# EAGLE design BRX (EAGLE 6.2)
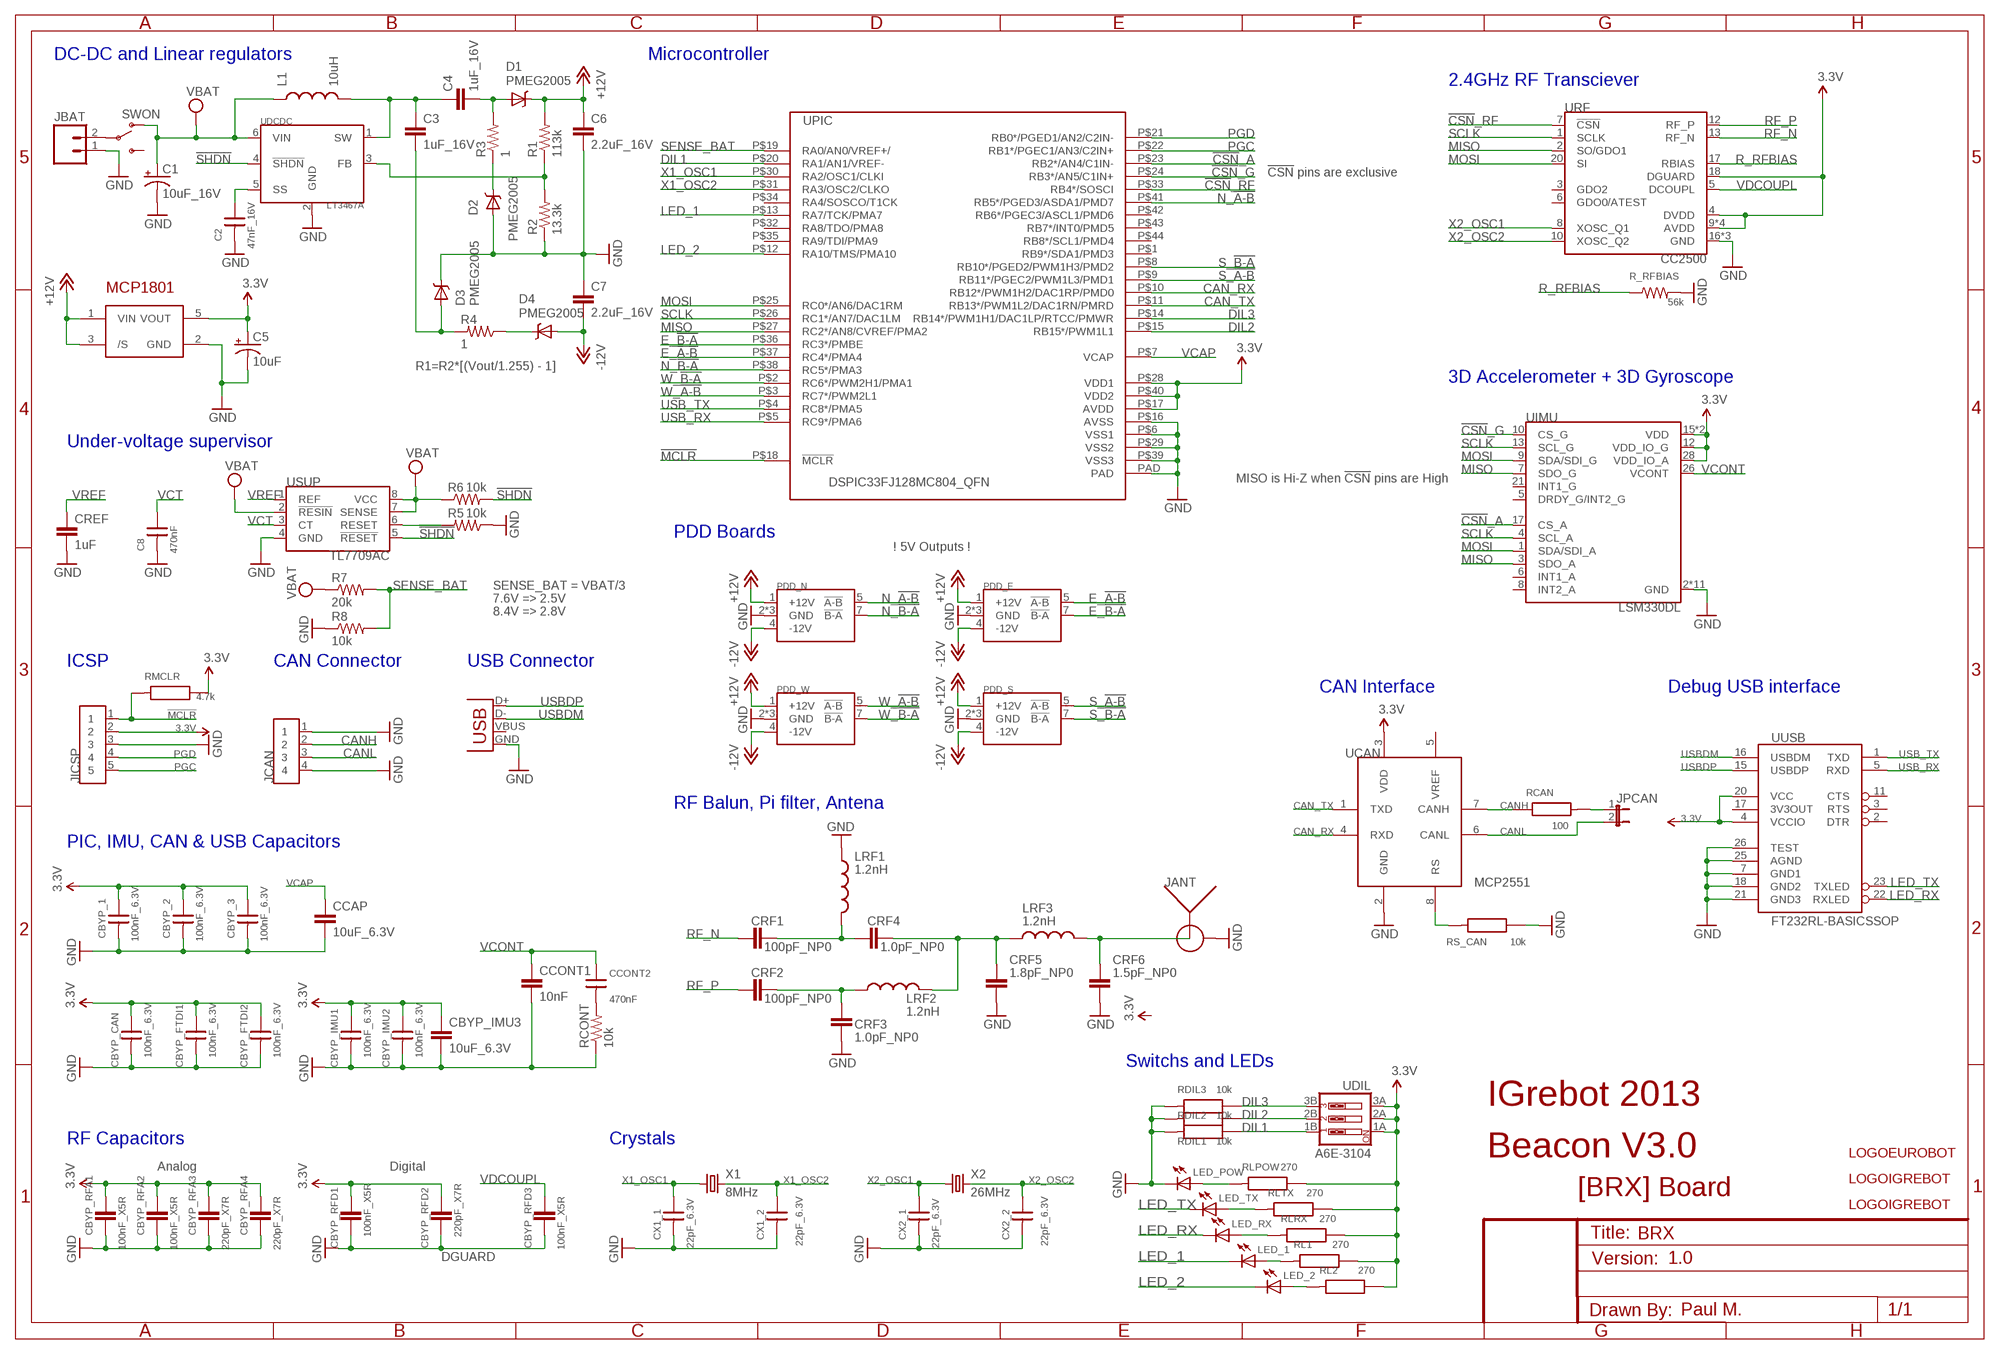
[diagram p0: schematic, sheet 1]

## Parts
C1  10uF_16V  CAP_POLC  [PANASONIC_C]
C2  47nF_16V  C0603  [R0603]
C3  1uF_16V  CAP1210  [1210]
C4  1uF_16V  CAP1210  [1210]
C5  10uF  CAP_POLC  [PANASONIC_C]
C6  2.2uF_16V  CAP1210  [1210]
C7  2.2uF_16V  CAP1210  [1210]
C8  470nF  C0603  [R0603]
CBYP_1  100nF_6.3V  C0603  [R0603]
CBYP_2  100nF_6.3V  C0603  [R0603]
CBYP_3  100nF_6.3V  C0603  [R0603]
CBYP_CAN  100nF_6.3V  C0603  [R0603]
CBYP_FTDI1  100nF_6.3V  C0603  [R0603]
CBYP_FTDI2  100nF_6.3V  C0603  [R0603]
CBYP_IMU1  100nF_6.3V  C0603  [R0603]
CBYP_IMU2  100nF_6.3V  C0603  [R0603]
CBYP_IMU3  10uF_6.3V  CAP1206  [1206]
CBYP_RFA1  100nF_X5R  CAP0402-CAP  [0402-CAP]
CBYP_RFA2  100nF_X5R  CAP0402-CAP  [0402-CAP]
CBYP_RFA3  220pF_X7R  CAP0402-CAP  [0402-CAP]
CBYP_RFA4  220pF_X7R  CAP0402-CAP  [0402-CAP]
CBYP_RFD1  100nF_X5R  CAP0402-CAP  [0402-CAP]
CBYP_RFD2  220pF_X7R  CAP0402-CAP  [0402-CAP]
CBYP_RFD3  100nF_X5R  CAP0402-CAP  [0402-CAP]
CCAP  10uF_6.3V  CAP1206  [1206]
CCONT1  10nF  CAP1206  [1206]
CCONT2  470nF  C0603  [R0603]
CREF  1uF  CAP1210  [1210]
CRF1  100pF_NP0  CAP0402-CAP  [0402-CAP]
CRF2  100pF_NP0  CAP0402-CAP  [0402-CAP]
CRF3  1.0pF_NP0  CAP0402-CAP  [0402-CAP]
CRF4  1.0pF_NP0  CAP0402-CAP  [0402-CAP]
CRF5  1.8pF_NP0  CAP0402-CAP  [0402-CAP]
CRF6  1.5pF_NP0  CAP0402-CAP  [0402-CAP]
CX1_1  22pF_6.3V  C0603  [R0603]
CX1_2  22pF_6.3V  C0603  [R0603]
CX2_1  22pF_6.3V  C0603  [R0603]
CX2_2  22pF_6.3V  C0603  [R0603]
D1  PMEG2005  DIODE-SCHOTTKY  [SOD-523]
D2  PMEG2005  DIODE-SCHOTTKY  [SOD-523]
D3  PMEG2005  DIODE-SCHOTTKY  [SOD-523]
D4  PMEG2005  DIODE-SCHOTTKY  [SOD-523]
JANT  ENG_CD_1814400_C1  [SMA-PCB-ANGLE]
JBAT  M02JST-PTH-2  [JST-2-PTH]
JCAN  SIL4  [CON4-2.54]
JICSP  SIL5  [CON5-2.54]
JPCAN  JUMPER-2PTH_LOCK  [1X02_LOCK]
JUSB  USBSMD  [USB-MINIB]
L1  10uH  MCSDC0503-221KU  [L-5X5]
LED_1  LED0603  [LED-0603]
LED_2  LED0603  [LED-0603]
LED_POW  LED0603  [LED-0603]
LED_RX  LED0603  [LED-0603]
LED_TX  LED0603  [LED-0603]
LRF1  1.2nH  INDUCTOR0402  [C0402]
LRF2  1.2nH  INDUCTOR0402  [C0402]
LRF3  1.2nH  INDUCTOR0402  [C0402]
PDD_E  PDD_BOARD  [PDD_SOCKET]
PDD_N  PDD_BOARD  [PDD_SOCKET]
PDD_S  PDD_BOARD  [PDD_SOCKET]
PDD_W  PDD_BOARD  [PDD_SOCKET]
R1  113k  RESISTOR0603-RES  [0603-RES]
R2  13.3k  RESISTOR0603-RES  [0603-RES]
R3  1  RESISTOR0603-RES  [0603-RES]
R4  1  RESISTOR0603-RES  [0603-RES]
R5  10k  RESISTOR0603-RES  [0603-RES]
R6  10k  RESISTOR0603-RES  [0603-RES]
R7  20k  RESISTOR0603-RES  [0603-RES]
R8  10k  RESISTOR0603-RES  [0603-RES]
R_RFBIAS  56k  RESISTOR0402-RES  [0402-RES]
RCAN  100  R0603  [R0603]
RCONT  10k  RESISTOR0603-RES  [0603-RES]
RDIL1  10k  R0603  [R0603]
RDIL2  10k  R0603  [R0603]
RDIL3  10k  R0603  [R0603]
RL1  270  R0603  [R0603]
RL2  270  R0603  [R0603]
RLPOW  270  R0603  [R0603]
RLRX  270  R0603  [R0603]
RLTX  270  R0603  [R0603]
RMCLR  4.7k  R0603  [R0603]
RS_CAN  10k  R0603  [R0603]
SWON  SWITCH-SPDTPTH  [SWITCH-SPDT]
U$3  LOGOEUROBOT  [LOGO_EUROBOT_1]
U$5  LOGOIGREBOT  [LOGO_IGREBOT]
U$9  LOGOIGREBOT  [LOGO_IGREBOT]
UCAN  MCP2551  [SO-08]
UDCDC  LT3467A  [TSOT-23]
UDIL  A6E-3104  [SW_DIP-3]
UIMU  LSM330DL  [LLGA-28]
UPIC  DSPIC33FJ128MC804_QFN  [QFN44-8X8]
UREG  MCP1801  [SOT23-5L]
URF  CC2500  [QFN20-0.5]
USUP  TL7709AC  [SOIC8]
UUSB  FT232RL-BASICSSOP  [SSOP28DB]
X1  8MHz  XTAL4.8_1.8  [XTAL_4.9-1.8]
X2  26MHz  XTAL4.8_1.8  [XTAL_4.9-1.8]

## Nets
3.3V: C5.+ CBYP_1.1 CBYP_2.1 CBYP_3.1 CBYP_CAN.1 CBYP_FTDI1.1 CBYP_FTDI2.1 CBYP_IMU1.1 CBYP_IMU2.1 CBYP_IMU3.1 CBYP_RFA1.2 CBYP_RFA2.2 CBYP_RFA3.2 CBYP_RFA4.2 CBYP_RFD1.2 CBYP_RFD2.2 JICSP.2 RL1.1 RL2.1 RLPOW.1 RLRX.1 RLTX.1 RMCLR.1 UCAN.3(VDD) UDIL.1A UDIL.2A UDIL.3A UIMU.12(VDD_IO_G) UIMU.15(VDD) UIMU.22(VDD) UIMU.28(VDD_IO_A) UPIC.P$17(AVDD) UPIC.P$28(VDD1) UPIC.P$40(VDD2) UREG.5(VOUT) URF.4(DVDD) URF.9(AVDD) URF.11(AVDD) URF.14(AVDD) URF.15(AVDD) URF.18(DGUARD) UUSB.4(VCCIO) UUSB.20(VCC)
!CSN!_A: UIMU.17(CS_A) UPIC.P$23(RB2*/AN4/C1IN-)
!CSN!_G: UIMU.10(CS_G) UPIC.P$24(RB3*/AN5/C1IN+)
!CSN!_RF: UPIC.P$33(RB4*/SOSCI) URF.7(!CSN!)
!MCLR!: JICSP.1 RMCLR.2 UPIC.P$18(!MCLR)
!SHDN!: R6.2 UDCDC.4(!SHDN!) USUP.5(!RESET!)
+12V: C6.1 D1.C PDD_E.1(+12V) PDD_N.1(+12V) PDD_S.1(+12V) PDD_W.1(+12V) R1.2 UREG.1(VIN) UREG.3(/S)
-12V: C7.1 D4.A PDD_E.4(-12V) PDD_N.4(-12V) PDD_S.4(-12V) PDD_W.4(-12V)
CAN_RX: UCAN.4(RXD) UPIC.P$10(RB12*/PWM1H2/DAC1RP/PMD0)
CAN_TX: UCAN.1(TXD) UPIC.P$11(RB13*/PWM1L2/DAC1RN/PMRD)
CANH: JCAN.2 RCAN.1 UCAN.7(CANH)
CANL: JCAN.3 JPCAN.2 UCAN.6(CANL)
DIL1: RDIL1.1 UDIL.1B UPIC.P$20(RA1/AN1/VREF-)
DIL2: RDIL2.1 UDIL.2B UPIC.P$15(RB15*/PWM1L1)
DIL3: RDIL3.1 UDIL.3B UPIC.P$14(RB14*/PWM1H1/DAC1LP/RTCC/PMWR)
E_!A-B!: PDD_E.5(!A-B!) UPIC.P$37(RC4*/PMA4)
E_!B-A!: PDD_E.7(!B-A!) UPIC.P$36(RC3*/PMBE)
GND: C1.- C2.2 C5.- C6.2 C7.2 C8.2 CBYP_1.2 CBYP_2.2 CBYP_3.2 CBYP_CAN.2 CBYP_FTDI1.2 CBYP_FTDI2.2 CBYP_IMU1.2 CBYP_IMU2.2 CBYP_IMU3.2 CBYP_RFA1.1 CBYP_RFA2.1 CBYP_RFA3.1 CBYP_RFA4.1 CBYP_RFD1.1 CBYP_RFD2.1 CBYP_RFD3.1 CCAP.2 CCONT1.2 CREF.1 CRF3.1 CRF5.1 CRF6.1 CX1_1.2 CX1_2.2 CX2_1.2 CX2_2.2 D2.A D3.C JANT.B1(B) JANT.B2(B) JANT.B3(B) JANT.B4(B) JBAT.1 JCAN.1 JCAN.4 JICSP.3 JUSB.GND LED_POW.C LRF1.1 PDD_E.2(GND) PDD_E.3(GND) PDD_E.6(GND) PDD_N.2(GND) PDD_N.3(GND) PDD_N.6(GND) PDD_S.2(GND) PDD_S.3(GND) PDD_S.6(GND) PDD_W.2(GND) PDD_W.3(GND) PDD_W.6(GND) R2.1 R5.1 R8.1 R_RFBIAS.2 RCONT.1 RDIL1.2 RDIL2.2 RDIL3.2 RS_CAN.1 UCAN.2(GND) UDCDC.2(GND) UIMU.2(GND) UIMU.11(GND) UIMU.14(GND) UIMU.16(GND) UIMU.18(GND) UIMU.19(GND) UIMU.20(GND) UIMU.23(GND) UIMU.24(GND) UIMU.25(GND) UIMU.27(GND) UPIC.P$6(VSS1) UPIC.P$16(AVSS) UPIC.P$29(VSS2) UPIC.P$39(VSS3) UPIC.PAD UREG.2(GND) URF.16(GND) URF.19(GND) URF.PAD(GND) USUP.4(GND) UUSB.7(GND1) UUSB.18(GND2) UUSB.21(GND3) UUSB.25(AGND) UUSB.26(TEST)
LED_1: LED_1.C UPIC.P$13(RA7/TCK/PMA7)
LED_2: LED_2.C UPIC.P$12(RA10/TMS/PMA10)
LED_RX: LED_RX.C UUSB.22(RXLED)
LED_TX: LED_TX.C UUSB.23(TXLED)
MISO: UIMU.3(SDO_A) UIMU.7(SDO_G) UPIC.P$27(RC2*/AN8/CVREF/PMA2) URF.2(SO/GDO1)
MOSI: UIMU.1(SDA/SDI_A) UIMU.9(SDA/SDI_G) UPIC.P$25(RC0*/AN6/DAC1RM) URF.20(SI)
N$1: CRF1.2 CRF4.2 LRF1.2
N$2: LED_TX.A RLTX.2
N$3: CRF2.2 CRF3.2 LRF2.1
N$4: CRF4.1 CRF5.2 LRF2.2 LRF3.1
N$5: RS_CAN.2 UCAN.8(RS)
N$6: JPCAN.1 RCAN.2
N$7: CRF6.2 JANT.A LRF3.2
N$8: LED_RX.A RLRX.2
N$9: LED_1.A RL1.2
N$10: LED_2.A RL2.2
N$11: C2.1 UDCDC.5(SS)
N$12: JBAT.2 SWON.2(P)
N$13: C3.1 C4.1 L1.2 UDCDC.1(SW)
N$14: C3.2 D3.A R4.2
N$15: D2.C R3.1
N$16: C4.2 D1.A R3.2
N$17: R5.2 USUP.6(RESET)
N$18: R1.1 R2.2 UDCDC.3(FB)
N$19: D4.C R4.1
N$20: CCONT2.2 RCONT.2
N$22: LED_POW.A RLPOW.2
N_!A-B!: PDD_N.5(!A-B!) UPIC.P$41(RB5*/PGED3/ASDA1/PMD7)
N_!B-A!: PDD_N.7(!B-A!) UPIC.P$38(RC5*/PMA3)
PGC: JICSP.5 UPIC.P$22(RB1*/PGEC1/AN3/C2IN+)
PGD: JICSP.4 UPIC.P$21(RB0*/PGED1/AN2/C2IN-)
R_RFBIAS: R_RFBIAS.1 URF.17(RBIAS)
RF_N: CRF1.1 URF.13(RF_N)
RF_P: CRF2.1 URF.12(RF_P)
S_!A-B!: PDD_S.5(!A-B!) UPIC.P$9(RB11*/PGEC2/PWM1L3/PMD1)
S_!B-A!: PDD_S.7(!B-A!) UPIC.P$8(RB10*/PGED2/PWM1H3/PMD2)
SCLK: UIMU.4(SCL_A) UIMU.13(SCL_G) UPIC.P$26(RC1*/AN7/DAC1LM) URF.1(SCLK)
SENSE_BAT: R7.2 R8.2 UPIC.P$19(RA0/AN0/VREF+/)
USB_RX: UPIC.P$5(RC9*/PMA6) UUSB.5(RXD)
USB_TX: UPIC.P$4(RC8*/PMA5) UUSB.1(TXD)
USBDM: JUSB.D- UUSB.16(USBDM)
USBDP: JUSB.D+ UUSB.15(USBDP)
VBAT: C1.+ L1.1 R6.1 R7.1 SWON.1(O) UDCDC.6(VIN) USUP.2(!RESIN!) USUP.7(SENSE) USUP.8(VCC)
VCAP: CCAP.1 UPIC.P$7(VCAP)
VCONT: CCONT1.1 CCONT2.1 UIMU.26(VCONT)
VCT: C8.1 USUP.3(CT)
VDCOUPL: CBYP_RFD3.2 URF.5(DCOUPL)
VREF: CREF.2 USUP.1(REF)
W_!A-B!: PDD_W.5(!A-B!) UPIC.P$3(RC7*/PWM2L1)
W_!B-A!: PDD_W.7(!B-A!) UPIC.P$2(RC6*/PWM2H1/PMA1)
X1_OSC1: CX1_1.1 UPIC.P$30(RA2/OSC1/CLKI) X1.P$1
X1_OSC2: CX1_2.1 UPIC.P$31(RA3/OSC2/CLKO) X1.P$2
X2_OSC1: CX2_1.1 URF.8(XOSC_Q1) X2.P$1
X2_OSC2: CX2_2.1 URF.10(XOSC_Q2) X2.P$2
Unconnected: JUSB.VBUS SWON.3(S) UCAN.5(VREF) UIMU.5(DRDY_G/INT2_G) UIMU.6(INT1_A) UIMU.8(INT2_A) UIMU.21(INT1_G) UPIC.P$1(RB9*/SDA1/PMD3) UPIC.P$32(RA8/TDO/PMA8) UPIC.P$34(RA4/SOSCO/T1CK) UPIC.P$35(RA9/TDI/PMA9) UPIC.P$42(RB6*/PGEC3/ASCL1/PMD6) UPIC.P$43(RB7*/INT0/PMD5) UPIC.P$44(RB8*/SCL1/PMD4) URF.3(GDO2) URF.6(GDO0/ATEST) UUSB.2(DTR) UUSB.3(RTS) UUSB.11(CTS) UUSB.17(3V3OUT)

## Notes on the sheet
- DC-DC and Linear regulators | Microcontroller
- 2.4GHz RF Transciever
- !CSN! pins are exclusive
- R1=R2*[(Vout/1.255) - 1]
- 3D Accelerometer + 3D Gyroscope
- Under-voltage supervisor
- MISO is Hi-Z when !CSN! pins are High
- PDD Boards
- \! 5V Outputs \!
- SENSE_BAT = VBAT/3
- 7.6V => 2.5V
- 8.4V => 2.8V
- ICSP | CAN Connector | USB Connector
- CAN Interface | Debug USB interface
- RF Balun, Pi filter, Antena
- PIC, IMU, CAN & USB Capacitors
- Switchs and LEDs
- IGrebot 2013
- RF Capacitors | Crystals
- Beacon V3.0
- Analog | Digital
- [BRX] Board
- DGUARD | 1.0
- Paul M.

## Library data of the parts
C1 C5 = SparkFun-Passives:CAP_POL: Capacitor Polarized These are standard SMD and PTH capacitors. Normally 10uF, 47uF, and 100uF in electrolytic and tantalum varieties. Always verify the external diameter of the through hole cap, it varies with capacity, voltage, and manufacturer. The EIA devices should be standard.
C2 C8 CBYP_1-CBYP_3 CBYP_CAN CBYP_FTDI1 CBYP_FTDI2 CBYP_IMU1 CBYP_IMU2 CCONT2 CX1_1 CX1_2 CX2_1 CX2_2 = 0SBLib:C
C3 C4 C6 C7 CBYP_RFA1-CBYP_RFA4 CBYP_RFD1-CBYP_RFD3 CREF CRF1-CRF6 = SparkFun-Passives:CAP: Capacitor Standard 0603 ceramic capacitor, and 0.1" leaded capacitor.
CBYP_IMU3 CCAP CCONT1 = SparkFun:CAP: Capacitor Standard 0603 ceramic capacitor, and 0.1" leaded capacitor.
D1-D4 = SparkFun-DiscreteSemi:DIODE-SCHOTTKY: Commonly MBRA140.
JANT = lib_paul_v6:ENG_CD_1814400_C1
JBAT = SparkFun-Connectors:M02: Header 2 Standard 2-pin 0.1" header. Use with straight break away headers (SKU : PRT-00116), right angle break away headers (PRT-00553), swiss pins (PRT-00743), machine pins (PRT-00117), and female headers (PRT-00115). Molex polarized connector foot print use with SKU : PRT-08233 with associated crimp pins and housings.
JCAN = lib_paul_v6:SIL4
JICSP = lib_paul_v6:SIL5
JPCAN = SparkFun-Passives:JUMPER-2: Jumper Basic 0.1" spaced jumper. Use with breakaway headers.
JUSB = SparkFun:USB: USB Connectors USB-B-PTH is fully proven SKU : PRT-00139 USB-miniB is fully proven SKU : PRT-00587 USB-A-PCB is untested. USB-A-H is throughly reviewed, but untested. Spark Fun Electronics SKU : PRT-00437 USB-B-SMT is throughly reviewed, but untested. Needs silkscreen touching up. USB-A-S has not been used/tested USB-MB-H has not been used/tested
L1 = lib_paul_v6:MCSDC0503-221KU
LED_1 LED_2 LED_POW LED_RX LED_TX = SparkFun:LED: LEDs Standard schematic elements and footprints for 5mm, 3mm, 1206, and 0603 sized LEDs. 5mm - Spark Fun Electronics SKU : COM-00529 (and others)
LRF1-LRF3 = SparkFun-Passives:INDUCTOR: Inductors Basic Inductor/Choke - 0603 and 1206. Footprints are not proven and vary greatly between part numbers.
PDD_E PDD_N PDD_S PDD_W = lib_paul_v6:PDD_BOARD
R1-R8 R_RFBIAS RCONT = SparkFun-Passives:RESISTOR: Resistor Basic schematic elements and footprints for 0603, 1206, and PTH resistors.
RCAN RDIL1-RDIL3 RL1 RL2 RLPOW RLRX RLTX RMCLR RS_CAN = 0SBLib:R
SWON = SparkFun-Electromechanical:SWITCH-SPDT: SPST Switch Simple slide switch. Spark Fun Electronics SKU : COM-00102
U$3 U$5 U$9 = 0SBLib:LOGO
UCAN = 0SBLib:MCP2551: High-Speed CAN Transceiver
UDCDC = lib_paul_v6:LT3467A
UDIL = lib_paul_v6:A6E-3104
UIMU = lib_paul_v6:LSM330DL
UPIC = 0SBLib:DSPIC33FJ128MC804: High-Performance,16-bit Digital Signal Controller
UREG = 0SBLib:MCP1801
URF = lib_paul_v6:CC2500
USUP = lib_paul_v6:TL7709AC
UUSB = SparkFun:FT232RL-BASIC: USB UART This is the simplified version of the FT232RL unit. Only what you need, nothing you don't. Spark Fun Electronics SKU : COM-00650
X1 X2 = 0SBLib:XTAL

## Board
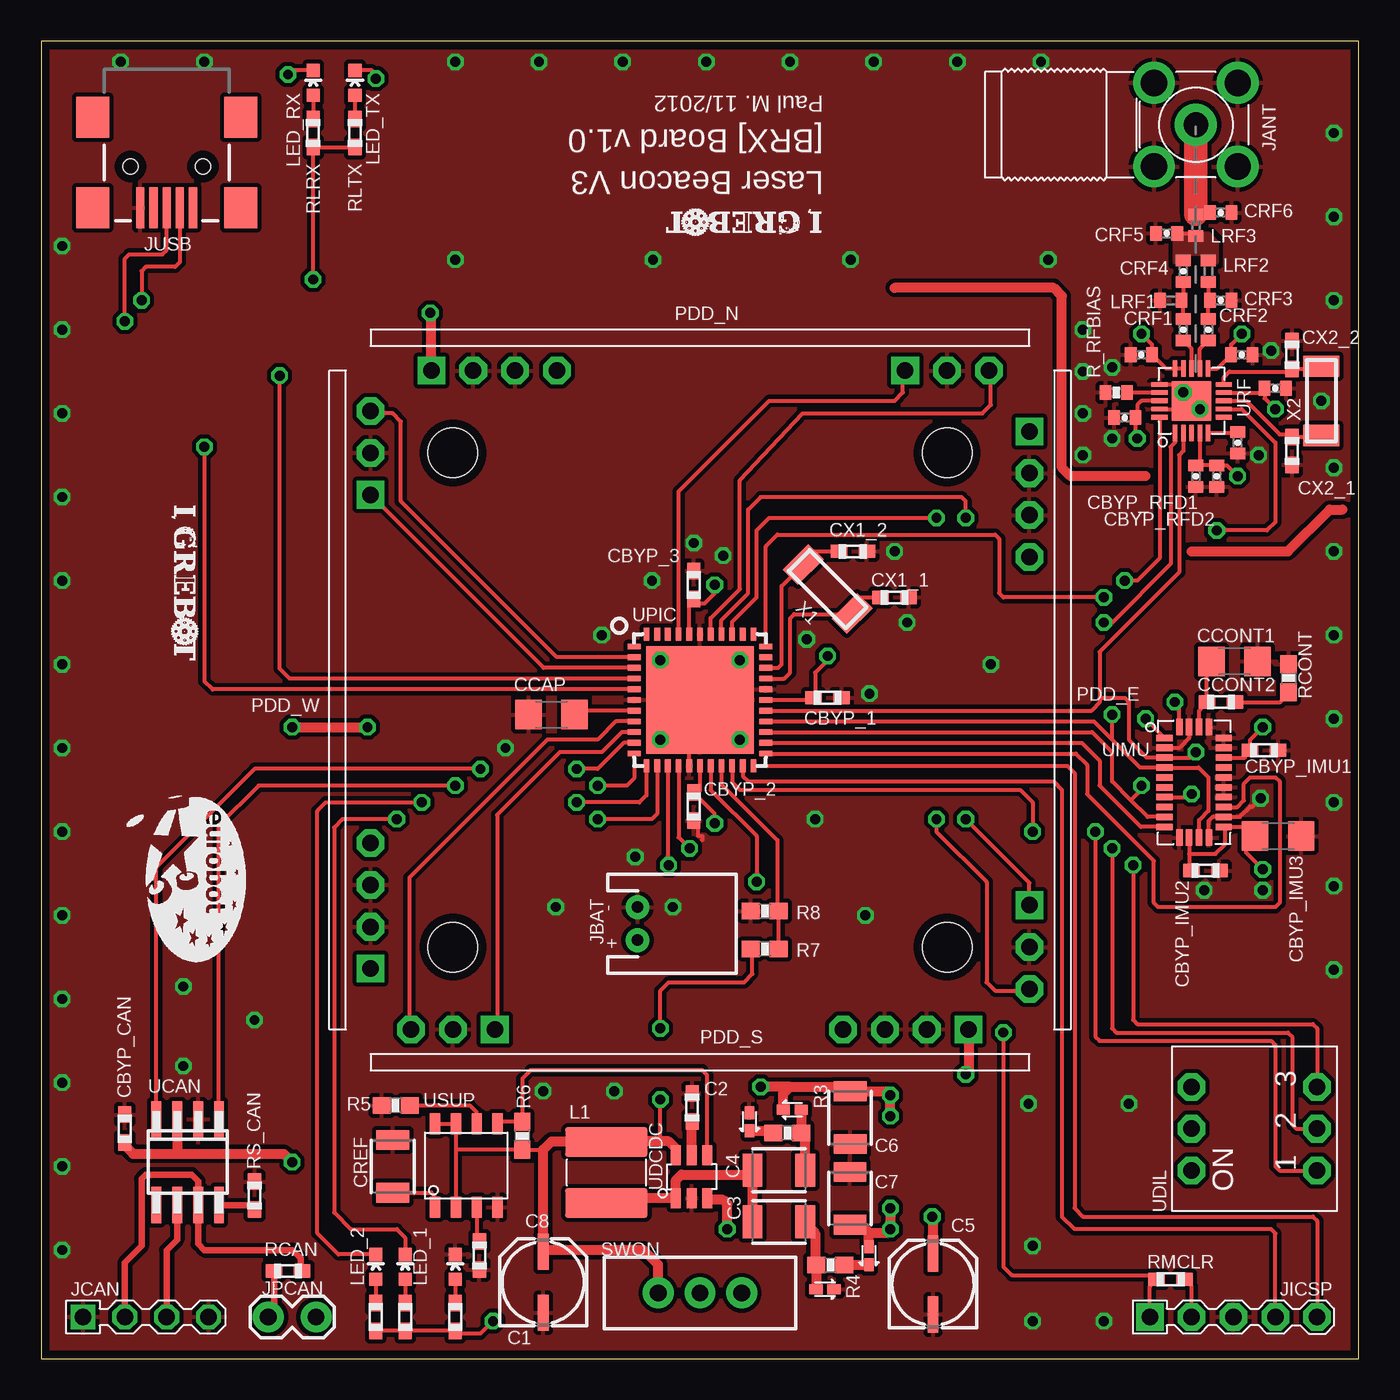
[diagram p1: board, top side]
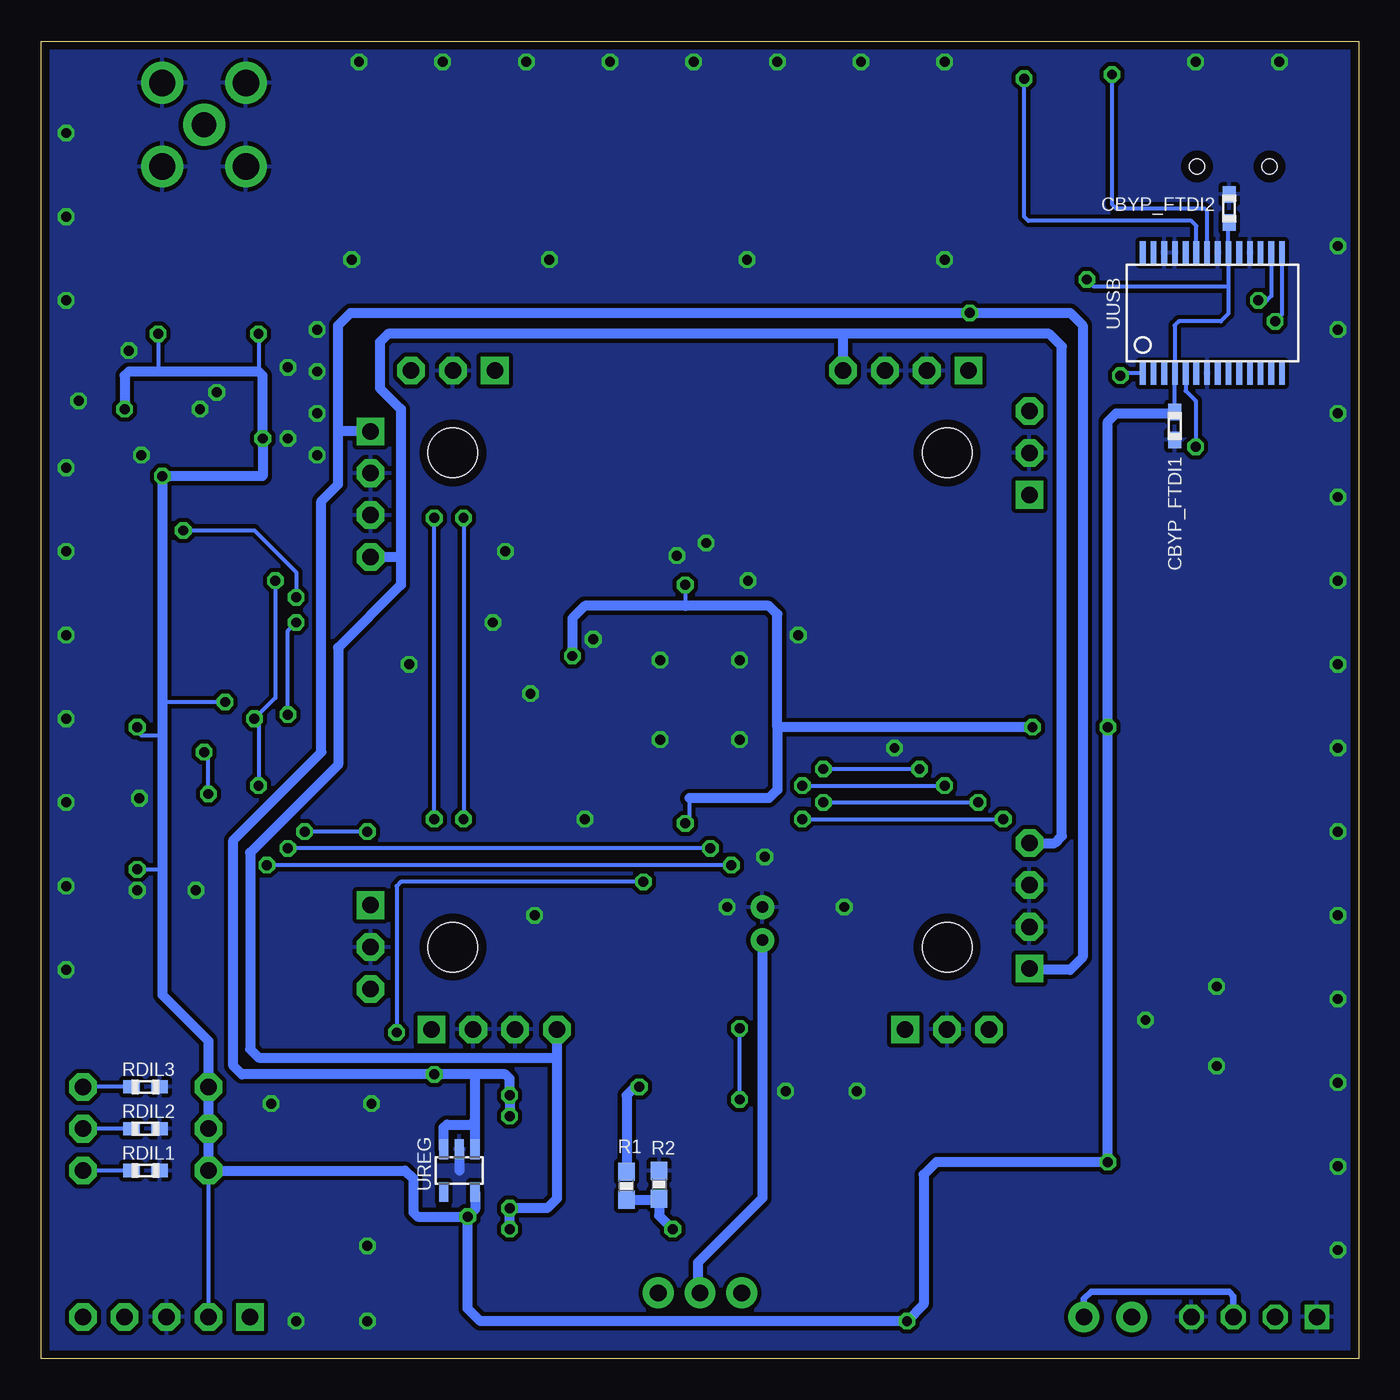
[diagram p2: board, bottom side, seen from below]

Size 80 x 80 mm. Coordinates in mm from the lower left corner, seen from the top.
Outline: 0,0 80,0 80,80 0,80 0,0
Copper layers (1*16): Top 0.035mm / dielectric 1.5mm / Bottom 0.035mm
Design rules: minimum track width 10mil, minimum drill 0.6mm, track to track 6mil, track to pad 6mil, pad to pad 6mil, via to via 6mil, smd to smd 6mil, copper to edge 20mil, drill to drill 8mil, minimum pad ring 10mil, minimum via ring 8mil, stop-mask expansion 4mil, vias tented up to drill 0mil, thermal gap 10mil
Holes 3 mm at 25,55 55,55 55,25 25,25

### Footprints (pad centres in the part's own frame; a part is rotated, then mirrored left to right if it is on the bottom)
PANASONIC_C = smd 2.2 x 0.65: + 1.9,-0.2; - -1.8,-0.2
R0603 = smd 1 x 0.8: 1 -0.85,0; 2 0.85,0
1210 = smd 1.2 x 2: 1 -1.6,0; 2 1.6,0
1206 = smd 1.6 x 1.8: 1 -1.4,0; 2 1.4,0
0402-CAP = smd 0.7 x 0.9: 1 -0.65,0; 2 0.65,0
SOD-523 = smd 0.8 x 0.6: A -0.55,0; C 0.55,0
SMA-PCB-ANGLE = drill 1.5 pad 2.54: A 0,0 | drill 1.6 pad 2.54: B1 -2.54,2.54; B2 2.54,2.54; B3 2.54,-2.54; B4 -2.54,-2.54
JST-2-PTH = drill 0.7 pad 1.448: 1 -1,0; 2 1,0
CON4-2.54 = drill 1 square: 1 -3.81,0 | drill 1 octagon: 2 -1.27,0; 3 1.27,0; 4 3.81,0
CON5-2.54 = drill 1 pad 1.676 square: 1 -5.08,0 | drill 1 pad 1.676 octagon: 2 -2.54,0; 3 0,0; 4 2.54,0; 5 5.08,0
1X02_LOCK = drill 1.016 pad 1.88: 1 -0.178,0; 2 2.718,0
USB-MINIB = smd 2.5 x 0.5: D+ 2.5,0; D- 2.5,0.8; GND 2.5,-1.6; ID 2.5,-0.8; VBUS 2.5,1.6 | smd 2.5 x 2: MTN1 -3,4.5; MTN2 2.5,4.5; MTN3 -3,-4.5; MTN4 2.5,-4.5 | hole 0.9: 0,2.2; 0,-2.2
L-5X5 = smd 1.8 x 5: 1 -1.85,0; 2 1.85,0
LED-0603 = smd 0.8 x 0.8: A 0,-0.75; C 0,0.75
C0402 = smd 0.7 x 0.9: 1 -0.65,0; 2 0.65,0
PDD_SOCKET = drill 1 pad 1.676 square: 1 -16.31,0; 5 12.46,0 | drill 1 pad 1.676 octagon: 2 -13.77,0; 3 -11.23,0; 4 -8.69,0; 6 15,0; 7 17.54,0
0603-RES = smd 1.1 x 1: 1 -0.85,0; 2 0.85,0
0402-RES = smd 0.7 x 0.9: 1 -0.65,0; 2 0.65,0
SWITCH-SPDT = drill 1.016 pad 1.88: 1 0,2.54; 2 0,0; 3 0,-2.54
SO-08 = smd 0.6 x 2.2: 1 -1.905,-2.6; 2 -0.635,-2.6; 3 0.635,-2.6; 4 1.905,-2.6; 5 1.905,2.6; 6 0.635,2.6; 7 -0.635,2.6; 8 -1.905,2.6
TSOT-23 = smd 0.6 x 1.2: 1 -0.95,-1.3; 2 0,-1.3; 3 0.95,-1.3; 4 0.95,1.3; 5 0,1.3; 6 -0.95,1.3
SW_DIP-3 = drill 1 pad 1.676 octagon: 1A -2.54,3.81; 1B -2.54,-3.81; 2A 0,3.81; 2B 0,-3.81; 3A 2.54,3.81; 3B 2.54,-3.81
LLGA-28 = smd 0.4 x 1: 1 2.7,1.8; 2 2.1,1.8; 3 1.5,1.8; 4 0.9,1.8; 5 0.3,1.8; 6 -0.3,1.8; 7 -0.9,1.8; 8 -1.5,1.8; 9 -2.1,1.8; 10 -2.7,1.8; 15 -2.7,-1.8; 16 -2.1,-1.8; 17 -1.5,-1.8; 18 -0.9,-1.8; 19 -0.3,-1.8; 20 0.3,-1.8; 21 0.9,-1.8; 22 1.5,-1.8; 23 2.1,-1.8; 24 2.7,-1.8 | smd 1 x 0.4: 11 -3.35,0.9; 12 -3.35,0.3; 13 -3.35,-0.3; 14 -3.35,-0.9; 25 3.35,-0.9; 26 3.35,-0.3; 27 3.35,0.3; 28 3.35,0.9
QFN44-8X8 = smd 0.8 x 0.35: P$1 -4,3.25; P$2 -4,2.6; P$3 -4,1.95; P$4 -4,1.3; P$5 -4,0.65; P$6 -4,0; P$7 -4,-0.65; P$8 -4,-1.3; P$9 -4,-1.95; P$10 -4,-2.6; P$11 -4,-3.25; P$23 4,-3.25; P$24 4,-2.6; P$25 4,-1.95; P$26 4,-1.3; P$27 4,-0.65; P$28 4,0; P$29 4,0.65; P$30 4,1.3; P$31 4,1.95; P$32 4,2.6; P$33 4,3.25 | smd 0.35 x 0.8: P$12 -3.25,-4; P$13 -2.6,-4; P$14 -1.95,-4; P$15 -1.3,-4; P$16 -0.65,-4; P$17 0,-4; P$18 0.65,-4; P$19 1.3,-4; P$20 1.95,-4; P$21 2.6,-4; P$22 3.25,-4; P$34 3.25,4; P$35 2.6,4; P$36 1.95,4; P$37 1.3,4; P$38 0.65,4; P$39 0,4; P$40 -0.65,4; P$41 -1.3,4; P$42 -1.95,4; P$43 -2.6,4; P$44 -3.25,4 | smd 6.5 x 6.5: PAD 0,0
SOT23-5L = smd 0.55 x 1.2: 1 -0.95,-1.3; 2 0,-1.3; 3 0.95,-1.3; 4 0.95,1.3; 5 -0.95,1.3
QFN20-0.5 = smd 0.28 x 1: 1 -1,-1.95; 2 -0.5,-1.95; 3 0,-1.95; 4 0.5,-1.95; 5 1,-1.95; 11 1,1.95; 12 0.5,1.95; 13 0,1.95; 14 -0.5,1.95; 15 -1,1.95 | smd 1 x 0.28: 6 1.95,-1; 7 1.95,-0.5; 8 1.95,0; 9 1.95,0.5; 10 1.95,1; 16 -1.95,1; 17 -1.95,0.5; 18 -1.95,0; 19 -1.95,-0.5; 20 -1.95,-1 | smd 2.4 x 2.4: PAD 0,0
SOIC8 = smd 0.635 x 1.27: 1 -1.905,-2.54; 2 -0.635,-2.54; 3 0.635,-2.54; 4 1.905,-2.54; 5 1.905,2.54; 6 0.635,2.54; 7 -0.635,2.54; 8 -1.905,2.54
SSOP28DB = smd 0.348 x 1.397: 1 -4.225,-3.656; 2 -3.575,-3.656; 3 -2.925,-3.656; 4 -2.275,-3.656; 5 -1.625,-3.656; 6 -0.975,-3.656; 7 -0.325,-3.656; 8 0.325,-3.656; 9 0.975,-3.656; 10 1.625,-3.656; 11 2.275,-3.656; 12 2.925,-3.656; 13 3.575,-3.656; 14 4.225,-3.656; 15 4.225,3.656; 16 3.575,3.656; 17 2.925,3.656; 18 2.275,3.656; 19 1.625,3.656; 20 0.975,3.656; 21 0.325,3.656; 22 -0.325,3.656; 23 -0.975,3.656; 24 -1.625,3.656; 25 -2.275,3.656; 26 -2.925,3.656; 27 -3.575,3.656; 28 -4.225,3.656
XTAL_4.9-1.8 = smd 1.3 x 2.2: P$1 -2.1,0; P$2 2.1,0

### Placement (x,y rotation side)
C1  30.28,4.6 90 top
C2  39.52,15.26 90 top
C3  44.79,8.31 0 top
C4  44.79,11.44 0 top
C5  53.95,4.49 90 top
C6  49.11,14.64 270 top
C7  49.11,9.74 90 top
C8  26.61,6.27 270 top
CBYP_1  47.75,40.13 0 top
CBYP_2  39.62,33.53 270 top
CBYP_3  39.62,46.99 90 top
CBYP_CAN  5.08,13.97 90 top
CBYP_FTDI1  11.18,56.64 270 bottom
CBYP_FTDI2  7.87,69.85 90 bottom
CBYP_IMU1  74.25,36.95 0 top
CBYP_IMU2  70.69,29.64 0 top
CBYP_IMU3  75.1,31.74 0 top
CBYP_RFA1  72.9,60.96 180 top
CBYP_RFA2  66.8,60.96 0 top
CBYP_RFA3  65.79,57.15 0 top
CBYP_RFA4  74.93,58.93 180 top
CBYP_RFD1  70.1,53.59 90 top
CBYP_RFD2  71.37,53.59 90 top
CBYP_RFD3  72.64,55.63 90 top
CCAP  30.99,39.12 180 top
CCONT1  72.45,42.34 0 top
CCONT2  71.63,39.88 0 top
CREF  21.34,11.68 270 top
CRF1  69.34,62.48 90 top
CRF2  70.87,62.48 90 top
CRF3  71.63,64.26 180 top
CRF4  69.34,66.04 270 top
CRF5  68.33,68.33 0 top
CRF6  71.63,69.6 180 top
CX1_1  51.82,46.23 0 top
CX1_2  49.28,49.02 0 top
CX2_1  75.95,55.12 270 top
CX2_2  75.95,60.96 90 top
D1  45.6,15.12 180 top
D2  43,14.39 270 top
D3  47.59,4.22 0 top
D4  50.26,6.26 270 top
JANT  70.11,74.93 180 top
JBAT  36.21,26.42 270 top
JCAN  6.35,2.54 0 top
JICSP  72.39,2.54 0 top
JPCAN  13.97,2.54 0 top
JUSB  7.62,72.39 270 top
L1  34.31,11.31 270 top
LED_1  22.1,5.59 0 top
LED_2  20.32,5.59 0 top
LED_POW  25.15,5.59 0 top
LED_RX  16.51,77.47 0 top
LED_TX  19.05,77.47 0 top
LRF1  68.58,64.26 0 top
LRF2  70.87,66.04 90 top
LRF3  70.1,68.83 90 top
PDD_E  60,40 270 top
PDD_N  40,60 0 top
PDD_S  40,20 180 top
PDD_W  20,40 90 top
R1  44.47,10.5 90 bottom
R2  42.48,10.58 270 bottom
R3  45.3,13.71 0 top
R4  47.92,5.7 180 top
R5  21.52,15.38 0 top
R6  29.21,13.54 90 top
R7  43.94,24.89 0 top
R8  43.94,27.18 0 top
R_RFBIAS  65.28,58.67 180 top
RCAN  14.99,5.33 180 top
RCONT  75.74,41.32 270 top
RDIL1  73.66,11.43 0 bottom
RDIL2  73.66,13.97 0 bottom
RDIL3  73.66,16.51 0 bottom
RL1  22.1,2.54 90 top
RL2  20.32,2.54 90 top
RLPOW  25.15,2.54 90 top
RLRX  16.51,74.42 90 top
RLTX  19.05,74.42 90 top
RMCLR  68.58,4.83 180 top
RS_CAN  12.95,9.91 270 top
SWON  40,4 90 top
U$3  4.7,34.67 270 top
U$5  47.5,69.98 180 top
U$9  7.75,51.94 270 top
UCAN  8.89,11.94 180 top
UDCDC  39.49,11.05 0 top
UDIL  73.66,13.97 90 top
UIMU  70,35 90 top
UPIC  40,40 0 top
UREG  54.61,11.43 180 bottom
URF  69.85,58.17 0 top
USUP  25.81,11.73 0 top
UUSB  8.89,63.5 0 bottom
X1  47.75,46.74 135 top
X2  77.72,58.17 90 top

### Tracks (layer width: path | path; a pad name or v marks a point on that pad's centre or on a via)
3.3V  (via drill 0.6)
  Top 0.254: URF.9 74.02,58.67 CBYP_RFA4.2 74.28,58.31 v74.93,57.66 | URF.4 70.35,54.49 CBYP_RFD1.2 CBYP_RFD2.2 71.99,54.24 v72.64,53.59 | URF.18 66.8,58.17 66.55,57.91 66.55,57.26 CBYP_RFA3.2 66.44,55.99 v66.55,55.88 | URF.14 URF.15 68.3,60.12 CBYP_RFA2.2 67.45,61.58 v66.8,62.23 | URF.11 71.4,60.12 CBYP_RFA1.2 72.25,61.58 v72.9,62.23 | UPIC.P$28 46.77,40 CBYP_1.1 | UPIC.P$40 39.35,45.87 | 39.35,45.87 CBYP_3.1 | JICSP.2 69.85,4.41 RMCLR.1 | 73.14,32.3 UIMU.15 71.88,32.22 71.88,31.24 71.3,30.66 69.7,30.66 | 73.14,32.3 CBYP_IMU3.1 | UIMU.22 73.08,36.5 CBYP_IMU1.1 73.4,37.58 v74.17,38.35 | 73.14,32.3 73.14,30.74 v74.17,29.72 | UIMU.12 69.7,30.66 | 69.7,30.66 69.7,29.78 CBYP_IMU2.1 | UIMU.28 69.1,39.61 v68.83,39.88 | RLTX.1 RLRX.1 v16.51,65.53 | v27.43,2.29 26.67,1.52 25.31,1.52 RLPOW.1 RL1.1 RL2.1 | 39.35,45.87 40.28,45.87 40.89,46.48 v40.89,46.99 | 46.74,40.3 CBYP_1.1 | UPIC.P$17 40,34.51 CBYP_2.1 40.89,33.11 v40.89,32.51 | v47.75,42.67 47.75,42.42 46.99,41.66 46.99,40.22 CBYP_1.1
  Top 0.61: C5.+ 54.15,8.84 v54.1,8.64 | CBYP_CAN.1 5.08,12.95 5.59,12.45 8.38,12.45 | 8.38,12.45 14.73,12.45 v15.24,11.94 | UCAN.3 8.26,12.57 8.38,12.45 | v15.24,38.35 v19.81,38.35
  Bottom 0.254: v66.8,62.23 66.8,59.94 | v72.9,62.23 72.9,60.2 73.15,59.94 | v74.17,38.35 74.17,38.1 73.91,37.85 72.64,37.85 | v74.17,29.72 72.64,29.72 | v68.83,39.88 72.64,39.88 | 7.92,65.11 UUSB.20 7.92,68.96 CBYP_FTDI2.1 | 7.92,65.11 7.92,63.46 8.38,62.99 10.92,62.99 11.18,62.74 11.18,59.85 UUSB.4 CBYP_FTDI1.1 | 7.92,65.11 16.08,65.11 v16.51,65.53 | v40.89,46.99 40.89,45.72 | 40.64,34.04 40.64,32.77 v40.89,32.51 | UDIL.1A JICSP.2
  Bottom 0.61: v74.93,57.66 74.93,59.69 74.68,59.94 73.15,59.94 66.8,59.94 66.55,59.69 v66.55,55.88 66.55,53.59 v72.64,53.59 72.64,39.88 72.64,37.85 72.64,29.72 72.64,22.1 69.85,19.3 UDIL.3A UDIL.2A UDIL.1A 57.91,11.43 57.4,10.92 57.4,8.89 57.15,8.64 v54.1,8.64 | v54.1,8.64 53.66,9.08 UREG.5 | v54.1,8.64 54.1,3.05 53.34,2.29 v27.43,2.29 26.42,3.3 26.42,11.18 25.65,11.94 v15.24,11.94 v15.24,38.35 15.24,56.9 14.73,57.4 11.26,57.4 CBYP_FTDI1.1 | v19.81,38.35 35.31,38.35 | 35.31,38.35 35.31,34.54 35.81,34.04 40.64,34.04 | 35.31,38.35 35.31,45.21 35.81,45.72 40.89,45.72 46.99,45.72 47.75,44.96 v47.75,42.67
!CSN!_A
  Top 0.254: UPIC.P$23 62.82,36.75 63.5,36.07 63.5,34.29 67.56,30.23 67.56,27.69 67.82,27.43 74.93,27.43 75.18,27.69 75.18,35.05 74.93,35.31 73.41,35.31 73.03,34.92 73.03,33.91 72.62,33.5 UIMU.17
!CSN!_G
  Top 0.254: UIMU.10 66.76,32.3 64.26,34.8 64.26,36.32 63.18,37.4 UPIC.P$24
!CSN!_RF  (via drill 0.6)
  Top 0.254: URF.7 72.89,57.67 74.93,55.63 74.93,50.8 74.42,50.29 v71.37,50.29 | UPIC.P$33 44,49.33 44.7,50.04 57.91,50.04 58.17,49.78 58.17,46.48 58.42,46.23 v64.52,46.23
  Bottom 0.254: v71.37,50.29 67.06,50.29 64.52,47.75 v64.52,46.23
!MCLR!  (via drill 0.6)
  Top 0.254: JICSP.1 67.31,4.41 RMCLR.2 67.48,5.08 58.93,5.08 58.42,5.59 v58.42,19.81 | UPIC.P$18 40.65,34.53 43.43,31.75 v43.43,28.96
  Bottom 0.254: v43.43,28.96 58.17,28.96 58.42,28.7 v58.42,19.81
!SHDN!
  Top 0.254: UDCDC.4 40.44,17.22 40.13,17.53 29.72,17.53 29.21,17.02 R6.2 27.83,14.39 USUP.5
+12V  (via drill 0.6)
  Top 0.61: D1.C 45.05,16.1 45.47,16.51 | 45.47,16.51 48.84,16.51 C6.1 51.32,16.24 v51.56,16 v51.56,14.73 | 45.47,16.51 v43.69,16.51 | PDD_S.1 56.31,17.45 v56.13,17.27 | PDD_N.1 23.69,63.31 v23.62,63.5
  Bottom 0.61: v51.56,14.73 v51.56,16 51.56,17.02 51.82,17.27 53.85,17.27 | v43.69,16.51 43.94,16.51 44.45,16 44.45,11.37 R1.2 | 53.85,17.27 v56.13,17.27 67.82,17.27 68.33,17.78 68.33,31.5 62.99,36.83 62.99,52.07 61.98,53.09 61.98,56.39 | 61.98,56.39 61.98,62.74 61.21,63.5 v23.62,63.5 17.53,63.5 16.76,62.74 16.76,24.38 17.53,23.62 19.93,23.62 PDD_W.1 | PDD_E.1 61.9,56.31 61.98,56.39 | UREG.1 53.66,14.48 | 53.66,14.48 53.66,17.08 53.85,17.27 | UREG.3 55.56,14.04 55.37,14.22 53.91,14.22 53.66,14.48
-12V  (via drill 0.6)
  Top 0.61: D4.A 50.26,7.65 | 50.26,7.65 49.78,8.13 49.12,8.13 C7.1 | 50.26,7.65 51.34,7.65 v51.56,7.87 v51.56,9.14
  Bottom 0.61: v51.56,7.87 v51.56,9.14 49.28,9.14 48.69,9.73 48.69,18.29 | PDD_W.4 18.47,31.31 18.03,31.75 18.03,61.47 18.8,62.23 31.24,62.23 | 31.24,62.23 58.93,62.23 59.44,61.72 59.44,58.93 58.17,57.66 58.17,48.77 | 58.17,48.77 58.17,46.99 61.98,43.18 61.98,36.07 67.31,30.73 67.31,18.8 66.8,18.29 48.69,18.29 | PDD_S.4 48.69,18.29 | PDD_E.4 58.24,48.69 58.17,48.77 | PDD_N.4 31.31,62.16 31.24,62.23
CAN_RX  (via drill 0.6)
  Top 0.254: UPIC.P$10 35.37,37.4 33.78,35.81 v32.51,35.81 | v26.67,35.81 12.95,35.81 12.57,35.43 12.45,35.31 6.99,29.84 UCAN.4
  Bottom 0.254: v32.51,35.81 v26.67,35.81
CAN_TX  (via drill 0.6)
  Top 0.254: UPIC.P$11 36,35.24 35.56,34.8 v33.78,34.8 | v25.15,34.8 13.21,34.8 10.79,32.38 UCAN.1
  Bottom 0.254: v33.78,34.8 v25.15,34.8
CANH
  Top 0.406: RCAN.1 15.75,5.42 15.75,6.1 15.24,6.6 9.91,6.6 9.53,6.99 UCAN.7 9.53,10.79 9.14,11.18 6.35,11.18 6.1,10.92 6.1,6.86 5.08,5.84 JCAN.2
CANL
  Top 0.406: UCAN.6 8.26,7.24 7.62,6.6 JCAN.3
  Bottom 0.406: JPCAN.2 16.69,3.63 16.26,4.06 7.87,4.06 7.62,3.81 JCAN.3
DIL1  (via drill 0.6)
  Top 0.254: UPIC.P$20 41.95,35.01 42.42,34.54 59.44,34.54 60.2,33.78 v60.2,32 | v64.01,32 64.01,19.56 64.26,19.3 74.68,19.3 74.93,19.05 74.93,11.68 75.18,11.43 UDIL.1B
  Bottom 0.254: v60.2,32 v64.01,32 | RDIL1.1 UDIL.1B
DIL2  (via drill 0.6)
  Top 0.254: UPIC.P$15 38.7,31.66 v39.37,30.99 | v65.02,30.99 65.02,20.07 65.28,19.81 75.69,19.81 75.95,19.56 75.95,14.22 76.2,13.97 UDIL.2B
  Bottom 0.254: v39.37,30.99 v65.02,30.99 | RDIL2.1 UDIL.2B
DIL3  (via drill 0.6)
  Top 0.254: UPIC.P$14 38.05,30.28 v38.1,29.97 | v66.29,29.97 66.29,20.57 66.55,20.32 77.22,20.32 77.47,20.07 UDIL.3B
  Bottom 0.254: v38.1,29.97 v66.29,29.97 | RDIL3.1 UDIL.3B
E_!A-B!  (via drill 0.6)
  Top 0.254: UPIC.P$37 41.3,44.86 42.93,46.48 42.93,51.56 43.69,52.32 55.88,52.32 56.13,52.07 v56.13,51.05 | PDD_E.5 60,28.9 v56.13,32.77
  Bottom 0.254: v56.13,32.77 v56.13,51.05
E_!B-A!  (via drill 0.6)
  Top 0.254: UPIC.P$36 41.95,44.74 43.43,46.23 43.43,50.29 44.2,51.05 v54.36,51.05 | v54.36,32.77 54.36,32 57.4,28.96 57.4,22.86 57.91,22.35 59.89,22.35 PDD_E.7
  Bottom 0.254: v54.36,51.05 v54.36,32.77
GND  (via drill 0.6)
  Top 0.254: URF.19 69.33,57.67 | 69.33,57.67 69.34,57.66 | URF.16 68.85,59.17 v69.34,58.67 | UPIC.P$16 39.35,37.57 39.37,37.59 | 39.37,37.59 v37.59,37.59 | 69.33,57.67 69.35,57.67 URF.PAD | UIMU.27 69.7,37.7 69.09,37.08 68.22,37.08 UIMU.2 | UIMU.14 70.87,31.68 70.87,32.64 71.13,32.9 UIMU.16 72.78,32.9 73.41,33.53 73.53,33.53 v74.04,34.04 | 39.37,37.59 40,37.59 UPIC.PAD | CBYP_2.2 39.88,32.68 39.88,31.75 40.13,31.75 40.13,31.5
  Bottom 0.61: UREG.2 54.61,11.43
  other vias: 77.72,58.17 65.02,60.2 65.02,55.88 70.36,57.66 74.68,61.21 73.91,54.86 63.25,54.86 63.25,57.4 63.25,59.94 63.25,62.48 70.61,28.45 74.17,28.45 50.29,40.39 51.82,49.02 52.58,44.7 57.66,42.16 39.62,49.53 37.08,47.24 34.04,43.94 28.19,37.08 46.48,43.69 41.4,48.77 37.59,42.42 42.42,42.42 42.42,37.59 60.71,78.74 55.63,78.74 50.55,78.74 45.47,78.74 40.39,78.74 35.31,78.74 30.23,78.74 25.15,78.74 9.91,78.74 4.83,78.74 1.27,67.56 1.27,62.48 1.27,57.4 1.27,52.32 1.27,47.24 1.27,42.16 1.27,37.08 1.27,32 1.27,26.92 1.27,21.84 1.27,16.76 1.27,11.68 1.27,6.6 78.49,54.1 78.49,49.02 78.49,43.94 78.49,38.86 78.49,33.78 78.49,28.7 78.49,23.62 25.15,66.74 37.15,66.74 49.15,66.74 78.49,64.26 78.49,69.34 78.49,74.42 61.15,66.74 30.48,16.26 34.8,16.26 59.94,15.49 60.2,6.86 66.04,15.49 60.2,2.29 64.52,2.29 8.64,17.78 8.64,22.61 12.95,20.57 36.07,30.48 38.35,27.43 31.24,27.43 50.04,26.92 46.99,32.77
  pour Bottom (isolate 0.254, rank 6): 0,0 80.01,0 80.01,80.01 0,80.01
  pour Top (isolate 0.254, rank 6): 0,0 80.01,0 80.01,80.01 0,80.01
LED_1  (via drill 0.6)
  Top 0.254: UPIC.P$13 37.4,33.08 37.08,32.77 v33.78,32.77 | v21.59,32.77 18.29,32.77 17.78,32.26 17.78,8.89 18.8,7.87 21.59,7.87 22.1,7.37 LED_1.C
  Bottom 0.254: v33.78,32.77 v21.59,32.77
LED_2  (via drill 0.6)
  Top 0.254: UPIC.P$12 36.75,34.21 36.32,33.78 v32.51,33.78 | LED_2.C 18.05,6.34 16.76,7.62 16.76,33.27 17.27,33.78 v23.11,33.78
  Bottom 0.254: v32.51,33.78 v23.11,33.78
LED_RX  (via drill 0.6)
  Top 0.254: LED_RX.C 15.23,78.22 v14.99,77.98
  Bottom 0.254: v14.99,77.98 14.99,70.1 14.73,69.85 9.4,69.85 9.21,69.67 UUSB.22
LED_TX  (via drill 0.6)
  Top 0.254: v20.32,77.72 20.32,77.98 20.07,78.23 19.06,78.23 LED_TX.C
  Bottom 0.254: UUSB.23 9.87,68.79 10.16,69.09 20.07,69.09 20.32,69.34 v20.32,77.72
MISO  (via drill 0.6)
  Top 0.254: URF.2 69.35,55.13 69.09,54.86 69.09,47.75 64.26,42.93 64.26,40.13 | UPIC.P$27 63.77,39.35 64.26,39.88 64.26,40.13 | UIMU.7 69.66,34.1 v69.85,34.29 | v70.1,36.83 69.77,36.5 UIMU.3 67.13,36.5 66.04,37.59 66.04,39.88 65.81,40.11 64.28,40.11 64.26,40.13
  Bottom 0.254: v69.85,34.29 69.85,36.58 v70.1,36.83
MOSI  (via drill 0.6)
  Top 0.254: URF.20 67.9,48.6 66.55,47.24 v65.79,47.24 | UIMU.9 67.18,32.9 66.17,33.91 | 66.17,33.91 65.02,35.05 65.02,36.83 63.8,38.05 UPIC.P$25 | UIMU.1 68.18,37.7 v67.06,38.86 | v66.8,34.8 66.8,34.54 66.17,33.91
  Bottom 0.254: v66.8,34.8 66.8,38.61 v67.06,38.86 65.79,40.13 v65.79,47.24
N$1
  Top 0.254: CRF1.2 69.34,64.15 LRF1.2 69.34,64.37 CRF4.2
N$2
  Top 0.254: LED_TX.A RLTX.2
N$3
  Top 0.254: CRF2.2 70.87,64.15 CRF3.2 70.87,64.37 LRF2.1
N$4
  Top 0.254: CRF5.2 70.1,68.33 70.1,68.07
  pour Top (no thermals): 68.83,66.55 68.83,67.82 69.34,68.33 70.87,68.33 71.37,67.82 71.37,66.55 70.61,66.55 70.61,67.06 69.6,67.06 69.6,66.55
N$5
  Top 0.406: UCAN.8 12.67,9.34 RS_CAN.2
N$6
  Top 0.406: RCAN.2 14.14,2.88 JPCAN.1
N$7
  Top 0.254: LRF3.2 arc-90 70.22,69.6 CRF6.2
  Top 1.422: LRF3.2 arc90 LRF3.2 JANT.A
N$8
  Top 0.254: LED_RX.A RLRX.2
N$9
  Top 0.254: LED_1.A RL1.2
N$10
  Top 0.254: LED_2.A RL2.2
N$11
  Top 0.61: UDCDC.5 39.49,14.38 C2.1
N$12
  Bottom 0.61: JBAT.2 36.21,9.76 40.13,5.84 40.13,4.13 SWON.2
N$13
  Top 0.61: L1.2 34.61,9.75 UDCDC.1 38.54,10.85 38.86,11.18 42.93,11.18 C4.1 C3.1
N$14
  Top 0.61: C3.2 46.39,8.22 46.99,7.62 46.99,5.78 R4.2 47.07,4.25 D3.A
N$15
  Top 0.61: D2.C 44.33,13.84 R3.1
N$16
  Top 0.61: C4.2 46.39,13.47 R3.2 D1.A
N$17
  Top 0.254: R5.2 26.02,15.38 26.42,14.99 26.42,14.3 USUP.6
N$18  (via drill 0.6)
  Top 0.61: v41.66,7.87 41.66,9.4 41.4,9.65 40.54,9.65 UDCDC.3
  Bottom 0.61: R1.1 42.55,9.65 R2.2 42.48,8.7 v41.66,7.87
N$19
  Top 0.61: R4.1 D4.C
N$20
  Top 0.254: CCONT2.2 75.22,39.88 RCONT.2
N$21
  Top 0.61: 69.85,49.02 75.69,49.02 78.23,51.56 78.99,51.56
N$22
  Top 0.254: LED_POW.A RLPOW.2
N_!A-B!
  Top 0.254: UPIC.P$41 38.7,52.67 44.2,58.17 51.82,58.17 52.32,58.67 52.32,59.86 PDD_N.5
N_!B-A!
  Top 0.254: PDD_N.7 57.66,59.88 57.66,57.91 57.15,57.4 46.23,57.4 42.42,53.34 42.42,46.74 40.65,44.97 UPIC.P$38
PGC
  Top 0.254: UPIC.P$22 62.3,36 62.74,35.56 62.74,9.14 63.25,8.64 77.22,8.64 77.47,8.38 JICSP.5
PGD
  Top 0.254: JICSP.4 74.93,7.62 74.68,7.87 62.74,7.87 61.98,8.64 61.98,34.54 61.47,35.05 42.93,35.05 42.6,35.38 UPIC.P$21
R_RFBIAS
  Top 0.254: URF.17 R_RFBIAS.1
RF_N
  Top 0.254: URF.13 69.85,61.33 CRF1.1
RF_P
  Top 0.254: URF.12 70.35,61.32 CRF2.1
S_!A-B!
  Top 0.254: UPIC.P$9 35.26,38.05 34.04,36.83 31.5,36.83 27.69,33.02 27.69,20.15 PDD_S.5
S_!B-A!
  Top 0.254: UPIC.P$8 34.89,38.7 33.78,37.59 30.73,37.59 22.35,29.21 22.35,20.11 PDD_S.7
SCLK  (via drill 0.6)
  Top 0.254: URF.1 68.85,55.64 68.58,55.37 68.58,48.26 65.02,44.7 v64.52,44.7 | UIMU.13 70.3,32.71 70.87,33.27 70.87,35.31 70.27,35.9 UIMU.4 66.72,35.9 65.02,37.59 | UPIC.P$26 63.92,38.7 65.02,37.59 | 65.02,37.59 v65.02,39.12
  Bottom 0.254: v65.02,39.12 65.02,44.2 v64.52,44.7
SENSE_BAT
  Top 0.254: UPIC.P$19 41.3,34.9 44.7,31.5 44.7,27.27 R8.2 R7.2
SHIELD
  Top 0.61: 67.06,53.59 62.48,53.59 61.98,54.1 61.98,64.52 61.47,65.02 51.82,65.02
USB_RX  (via drill 0.6)
  Top 0.254: UPIC.P$5 10.4,40.65 9.91,41.15 v9.91,55.37
  Bottom 0.254: UUSB.5 10.52,58.77 9.91,58.17 v9.91,55.37
USB_TX  (via drill 0.6)
  Top 0.254: UPIC.P$4 15.09,41.3 14.48,41.91 v14.48,59.69
  Bottom 0.254: UUSB.1 14.32,59.84 v14.48,59.69
USBDM  (via drill 0.6)
  Top 0.254: JUSB.D- 8.42,66.59 8.13,66.29 6.35,66.29 6.1,66.04 v6.1,64.26
  Bottom 0.254: v6.1,64.26 5.59,64.26 5.32,64.53 UUSB.16
USBDP  (via drill 0.6)
  Top 0.254: v5.08,62.99 5.08,66.8 5.33,67.06 7.37,67.06 7.62,67.31 JUSB.D+
  Bottom 0.254: UUSB.15 4.67,63.41 v5.08,62.99
VBAT  (via drill 0.6)
  Top 0.254: USUP.8 USUP.7 25.18,12.7 | 25.18,12.7 USUP.2 | 25.18,12.7 25.18,12.69 R6.1 30.47,12.69 30.48,12.7 | 37.59,13.21 v37.59,15.75 | v37.59,20.07 37.59,22.35 38.1,22.86 42.67,22.86 43.18,23.37 43.18,24.8 R7.1
  Top 0.61: SWON.1 37.46,5.72 36.58,6.6 30.59,6.6 C1.+ 30.48,12.7 30.99,13.21 34.27,13.21 L1.1 34.36,13.21 37.59,13.21 38.1,13.21 38.54,12.77 UDCDC.6
  Bottom 0.254: v37.59,15.75 v37.59,20.07
VCAP
  Top 0.254: UPIC.P$7 32.62,39.35 CCAP.1
VCONT
  Top 0.254: UIMU.26 70.3,39.34 CCONT2.1 70.78,42.07 CCONT1.1
VCT
  Top 0.254: USUP.3 26.45,7.29 C8.1
VDCOUPL
  Top 0.254: URF.5 72.45,56.22 CBYP_RFD3.2
VREF
  Top 0.254: 23.88,9.16 USUP.1 23.88,9.22 23.88,9.91 23.7,10.08 CREF.2
W_!A-B!
  Top 0.254: UPIC.P$3 30.51,41.95 PDD_W.5
W_!B-A!
  Top 0.254: UPIC.P$2 31.31,42.6 21.84,52.07 21.84,56.9 21.34,57.4 20.14,57.4 PDD_W.7
X1_OSC1
  Top 0.254: UPIC.P$30 45.11,41.3 45.47,41.66 45.47,44.96 45.72,45.21 48.44,45.21 X1.P$1 48.55,45.25 49.53,46.23 CX1_1.1
X1_OSC2
  Top 0.254: UPIC.P$31 44.74,41.95 44.96,42.16 44.96,46.91 X1.P$2 45.68,48.22 46.74,49.02 CX1_2.1
X2_OSC1
  Top 0.254: URF.8 73.15,58.17 75.18,56.13 75.78,56.13 CX2_1.1 77.63,55.97 X2.P$1
X2_OSC2
  Top 0.254: URF.10 71.8,59.61 72.14,59.94 75.78,59.94 CX2_2.1 77.57,60.11 X2.P$2

### Text on the board
tPlace: Paul M. 11/2012 | [BRX] Board v1.0 | Laser Beacon V3 | - | +